# Altium schematic sheet POWER.SchDoc
size A3; SheetNumber: 2; SheetTotal: 7
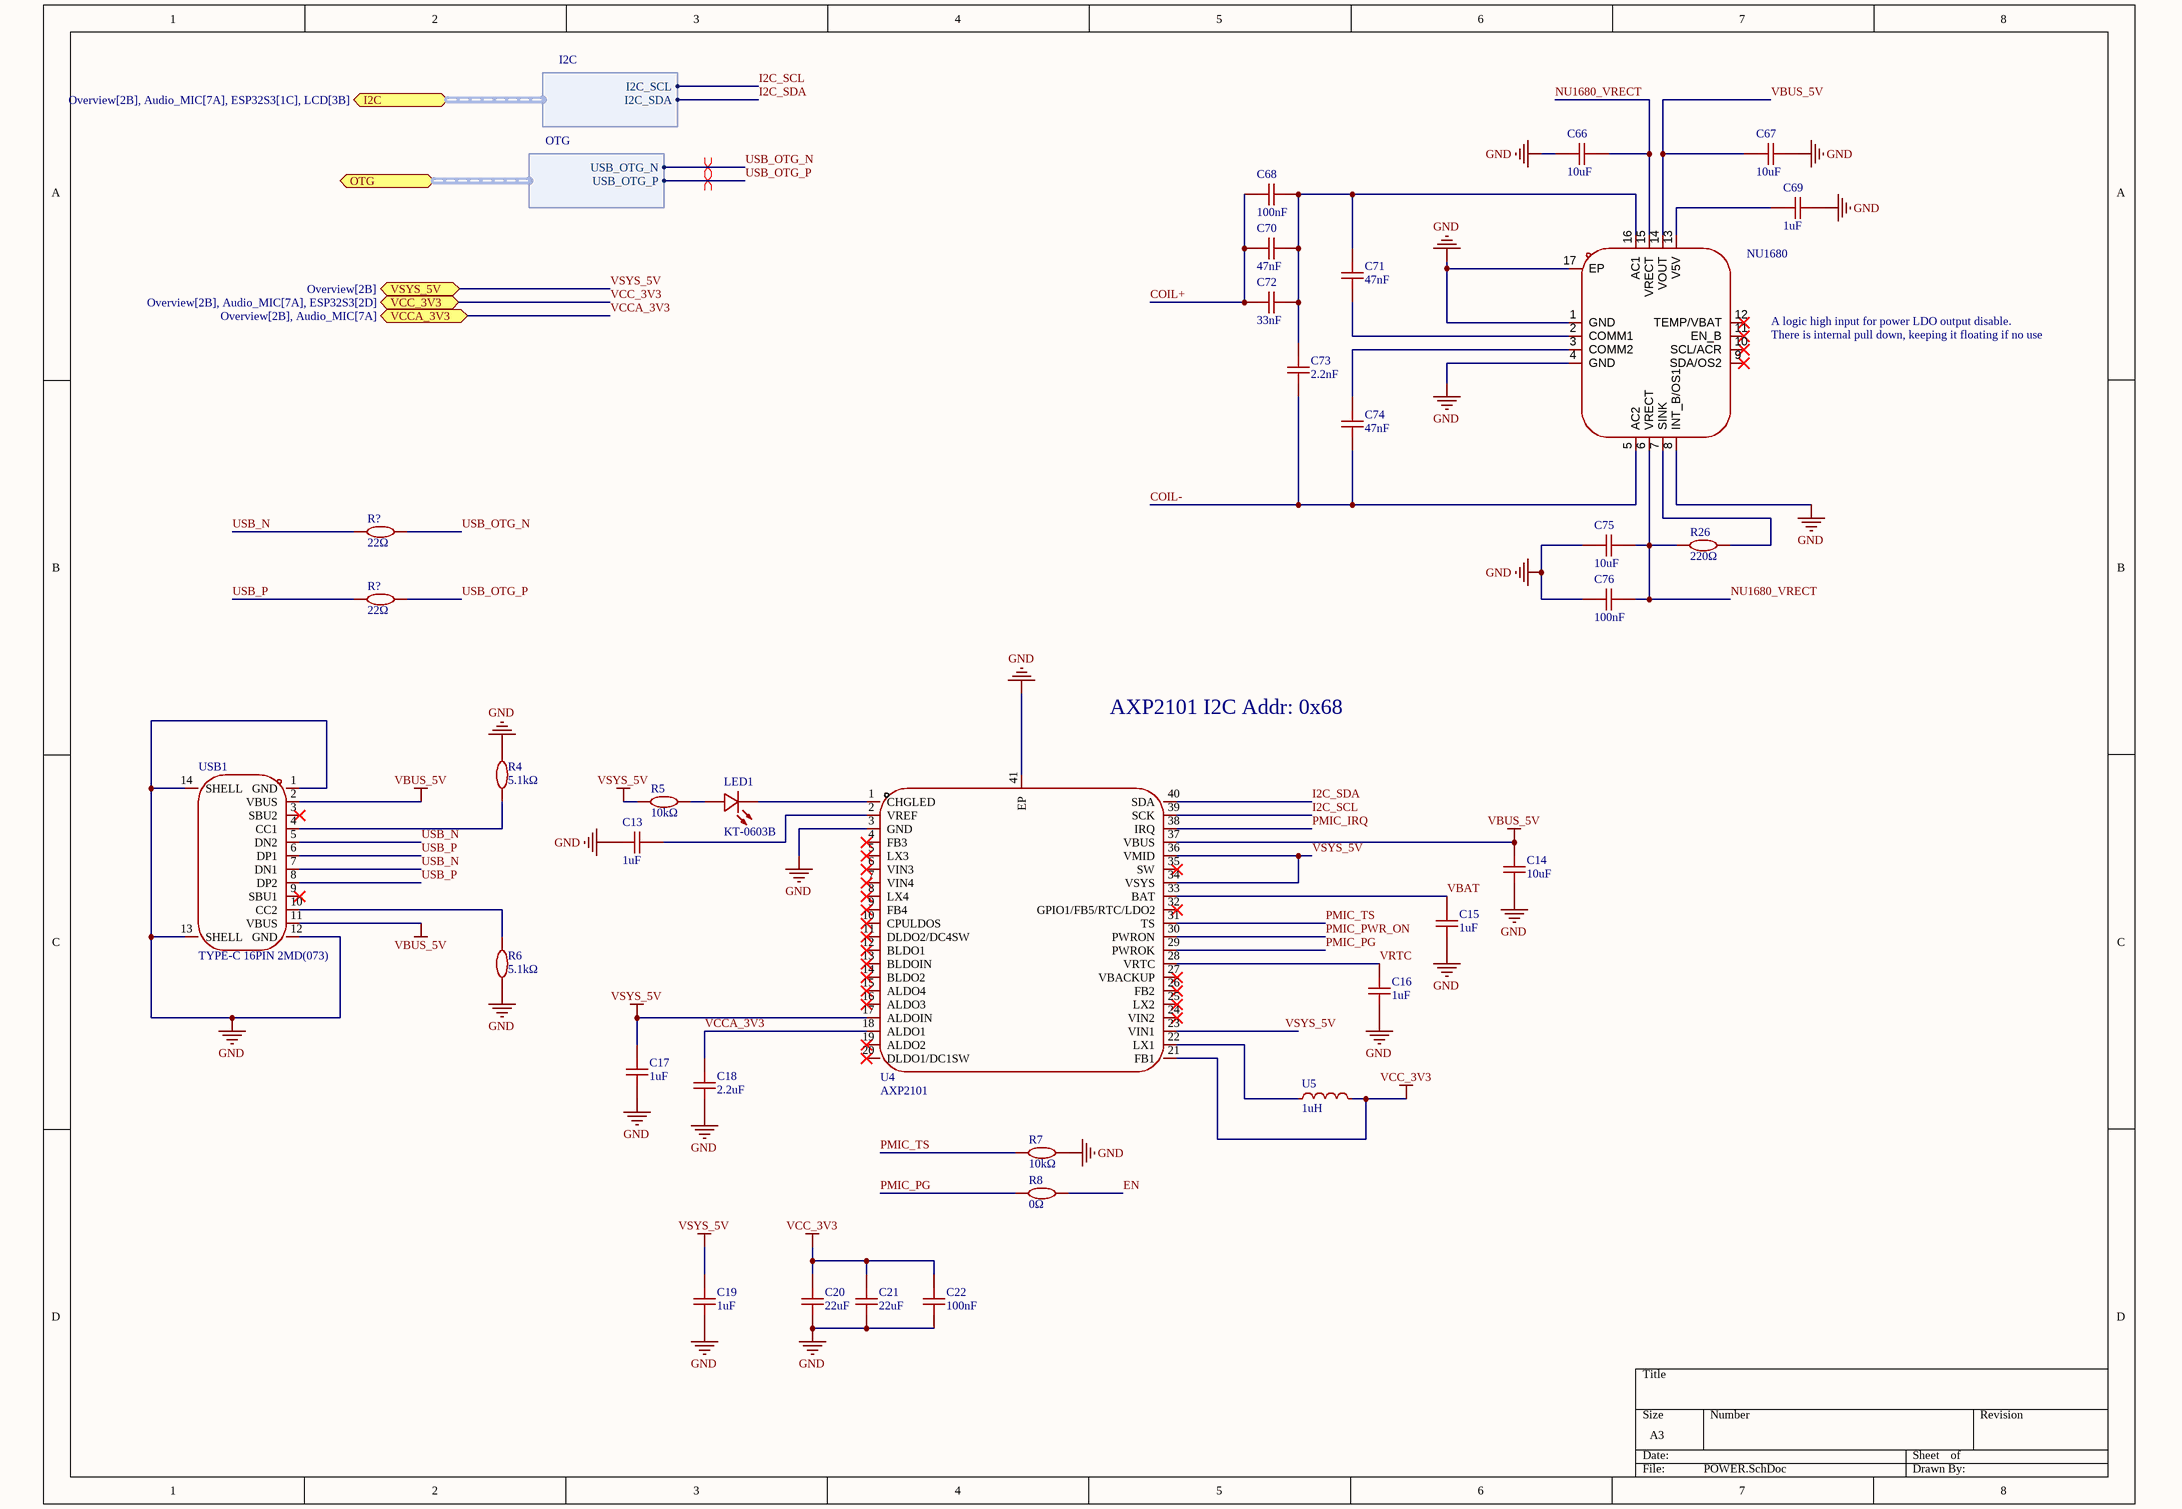
[diagram p0: POWER.SchDoc]

## Parts
(Parts that share a designator on the sheet are numbered #1, #2 ... from top to bottom, then left to right.)
C13  1uF  [C0402]
C14  10uF  [C0603]
C15  1uF  [C0402]
C16  1uF  [C0402]
C17  1uF  [C0402]
C18  2.2uF  [C0402]
C19  1uF  [C0402]
C20  22uF  [C0603]
C21  22uF  [C0603]
C22  100nF  [C0402]
C66  10uF  [C0603]
C67  10uF  [C0603]
C68  100nF  [C0402]
C69  1uF  [C0402]
C70  47nF  [C0402]
C71  47nF  [C0402]
C72  33nF  [C0402]
C73  2.2nF  [C0402]
C74  47nF  [C0402]
C75  10uF  [C0603]
C76  100nF  [C0402]
LED1  KT-0603B  [LED0603-BL]
R4  5.1kΩ  [R0402]
R5  10kΩ  [R0402]
R6  5.1kΩ  [R0402]
R7  10kΩ  [R0402]
R8  0Ω  [R0402]
R26  220Ω  [R0402]
R?#1  22Ω  [R0402]
R?#2  22Ω  [R0402]
U4  AXP2101  [QFN-40_L5.0-W5.0-P0.40-TL-EP3.4]
U5  1uH  [IND-SMD_L2.5-W2.0_WPN252012H]
U12  NU1680  [QFN-16_L3.0-W3.0-P0.50-TL-EP1.9]
USB1  TYPE-C 16PIN 2MD(073)  [USB-C-SMD_TYPE-C-6PIN-2MD-073]

## Ports
I2C (bidir, harness I2C, see Overview[2B], Audio_MIC[7A], ESP32S3[1C], LCD[3B]), OTG (bidir, harness OTG), VCC_3V3 (bidir, see Overview[2B], Audio_MIC[7A], ESP32S3[2D]), VCCA_3V3 (bidir, see Overview[2B], Audio_MIC[7A]), VSYS_5V (bidir, see Overview[2B])

## Harnesses
OTG: USB_OTG_N, USB_OTG_P
I2C: I2C_SCL, I2C_SDA

## Nets
GND: C13.1 C14.1 C15.1 C16.1 C17.1 C18.1 C19.1 C20.1 C21.1 C22.1 C66.2 C67.1 C69.1 C75.2 C76.2 R4.2 R6.1 R7.2 U4.3(GND) U4.41(EP) U12.1(GND) U12.4(GND) U12.8(INT_B/OS1) U12.17(EP) USB1.1(GND) USB1.12(GND) USB1.13(SHELL) USB1.14(SHELL)
VBUS_5V: C14.2 C67.2 U4.37(VBUS) U12.14(VOUT) USB1.2(VBUS) USB1.11(VBUS)
VCC_3V3: C20.2 C21.2 C22.2 U4.21(FB1) U5.2 ; port VCC_3V3
VSYS_5V: C17.2 C19.2 R5.1 U4.17(ALDOIN) U4.23(VIN1) U4.34(VSYS) U4.36(VMID) ; port VSYS_5V
COIL+: C68.2 C70.2 C72.2
COIL-: C73.1 C74.1 U12.5(AC2)
EN: R8.2
I2C_SCL: U4.39(SCK) ; port I2C.I2C_SCL
I2C_SDA: U4.40(SDA) ; port I2C.I2C_SDA
NU1680_VRECT: C66.1 C75.1 C76.1 R26.1 U12.6(VRECT) U12.15(VRECT)
PMIC_IRQ: U4.38(IRQ)
PMIC_PG: R8.1 U4.29(PWROK)
PMIC_PWR_ON: U4.30(PWRON)
PMIC_TS: R7.1 U4.31(TS)
USB_N: R?#1.2 USB1.5(DN2) USB1.7(DN1)
USB_OTG_N: R?#1.1 ; port OTG.USB_OTG_N
USB_OTG_P: R?#2.1 ; port OTG.USB_OTG_P
USB_P: R?#2.2 USB1.6(DP1) USB1.8(DP2)
VBAT: C15.2 U4.33(BAT)
VCCA_3V3: C18.2 U4.18(ALDO1) ; port VCCA_3V3
VRTC: C16.2 U4.28(VRTC)
NetC13_2: C13.2 U4.2(VREF)
NetC68_1: C68.1 C70.1 C71.2 C72.1 C73.2 U12.16(AC1)
NetC69_2: C69.2 U12.13(V5V)
NetC71_1: C71.1 U12.2(COMM1)
NetC74_2: C74.2 U12.3(COMM2)
NetLED1_1: LED1.1(K) U4.1(CHGLED)
NetLED1_2: LED1.2(A) R5.2
NetR4_1: R4.1 USB1.4(CC1)
NetR6_2: R6.2 USB1.10(CC2)
NetR26_2: R26.2 U12.7(SINK)
NetU4_22: U4.22(LX1) U5.1

Not connected (* = marked no-connect by the designer): U4 4(FB3)* 5(LX3)* 6(VIN3)* 7(VIN4)* 8(LX4)* 9(FB4)* 10(CPULDOS)* 11(DLDO2/DC4SW)* 12(BLDO1)* 13(BLDOIN)* 14(BLDO2)* 15(ALDO4)* 16(ALDO3)* 19(ALDO2)* 20(DLDO1/DC1SW)* 24(VIN2)* 25(LX2)* 26(FB2)* 27(VBACKUP)* 32(GPIO1/FB5/RTC/LDO2)* 35(SW)*; U12 9(SDA/OS2)* 10(SCL/ACR)* 11(EN_B)* 12(TEMP/VBAT)*; USB1 3(SBU2)* 9(SBU1)*

## Layout directives
differential pair: USB_OTG_N, USB_OTG_P

## Notes on the sheet
- (near U12) A logic high input for power LDO output disable.
- (near U12) There is internal pull down, keeping it floating if no use
- AXP2101 I2C Addr: 0x68

## Library data of the parts
C13 C15-C17 C19 C69 = 1uF: 50V 1uF X5R ±10% 0402 Ceramic Capacitors ROHS
C14 C66 C67 C75 = 10uF: 10V 10uF X5R ±10% 0603 Ceramic Capacitors ROHS
C18 C73 = 2.2uF: 50V 2.2uF NP0 0402 Ceramic Capacitors ROHS
C20 C21 = 22uF: 16V 22uF X5R ±20% 0603 Ceramic Capacitors ROHS
C22 C68 C76 = 100nF: 50V 100nF X7R ±10% 0402 Ceramic Capacitors ROHS
C70-C72 C74 = 470nF: 25V 470nF X5R ±10% 0402 Ceramic Capacitors ROHS
LED1 = KT-0603B: 30mA 2.6V~3.2V Blue 0603 LED Indication - Discrete ROHS
R4 R6 R?#1 R?#2 = 5.1kΩ: 5.1kΩ 62.5mW 50V ±100ppm/℃ Thick Film Resistor ±1% 0402 Chip Resistor - Surface Mount ROHS
R5 R7 = 10kΩ: 62.5mW 10kΩ 50V ±100ppm/℃ Thick Film Resistor ±1% 0402 Chip Resistor - Surface Mount ROHS
R8 = 0Ω: 0Ω 62.5mW 50V Thick Film Resistor ±1% 0402 Chip Resistor - Surface Mount ROHS
R26 = 220Ω: 小尺寸、重量轻。降低组装成本,与贴片机匹配。适用于波峰焊和回流焊
U5 = WPN252012H1R0MT
U12 = NU1680: 无线充电; Symbol: NU1680
USB1 = TYPE-C 16PIN 2MD(073): 16pin type-c